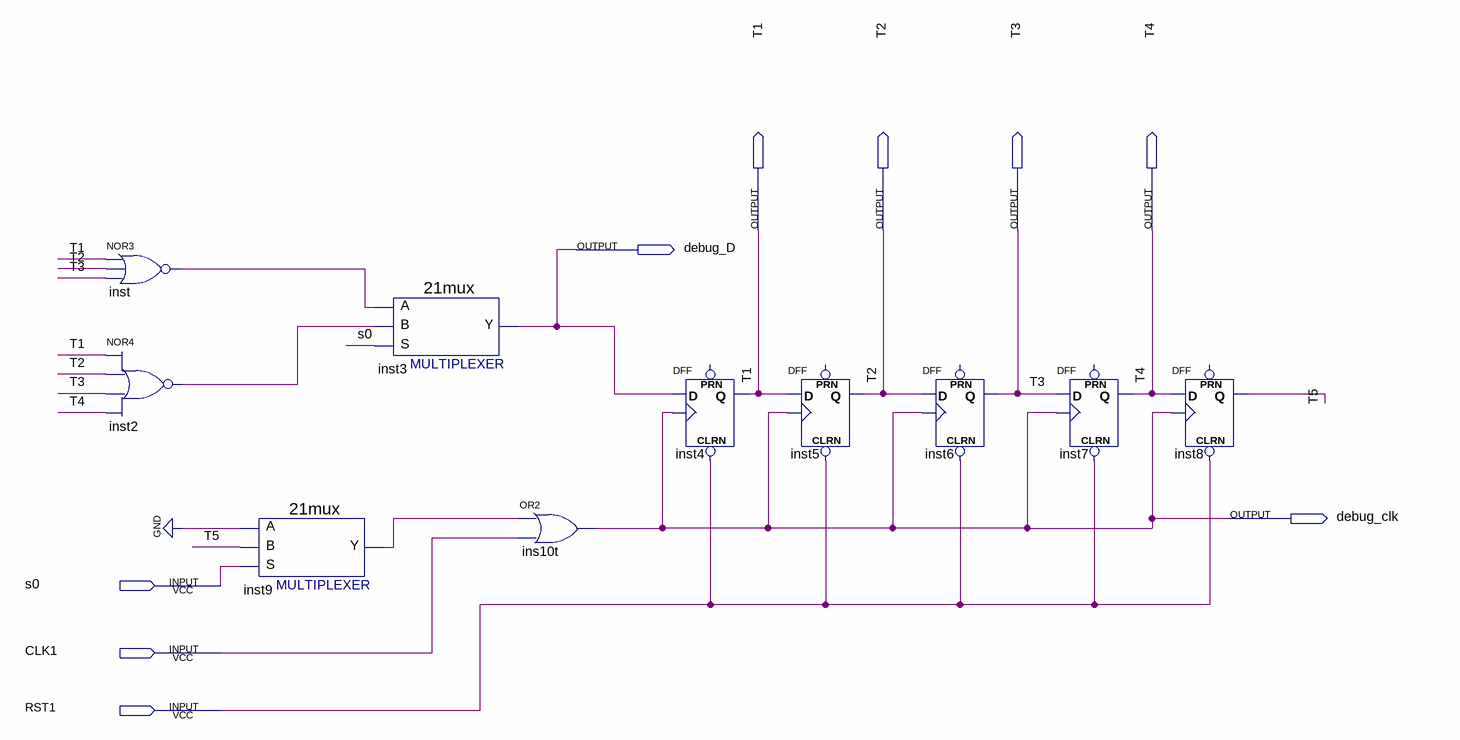
[diagram p0: schematic sheet]
// Quartus schematic timing2627.bdf as structural Verilog: 10 symbols, 9 pins
module timing2627 (
  input  s0,
  input  CLK1,
  input  RST1,
  output T1,
  output T2,
  output T3,
  output T4,
  output debug_D,
  output debug_clk
);

  wire inst2_out, inst9_y, inst_out, T5;

  nor inst (inst_out, T1, T2, T3);
  nor inst2 (inst2_out, T1, T2, T3, T4);
  \21mux  inst9 (.S(s0), .B(T5), .A(1'b0), .Y(inst9_y));
  \21mux  inst3 (.S(s0), .B(inst2_out), .A(inst_out), .Y(debug_D));
  or ins10t (debug_clk, inst9_y, CLK1);
  DFF inst4 (.CLRN(RST1), .CLK(debug_clk), .D(debug_D), .Q(T1));  // open: PRN
  DFF inst5 (.CLRN(RST1), .CLK(debug_clk), .D(T1), .Q(T2));  // open: PRN
  DFF inst6 (.CLRN(RST1), .CLK(debug_clk), .D(T2), .Q(T3));  // open: PRN
  DFF inst7 (.CLRN(RST1), .CLK(debug_clk), .D(T3), .Q(T4));  // open: PRN
  DFF inst8 (.CLRN(RST1), .CLK(debug_clk), .D(T4), .Q(T5));  // open: PRN
endmodule
